# EAGLE design SchemaRobotV1.0 (EAGLE 8.7.0)
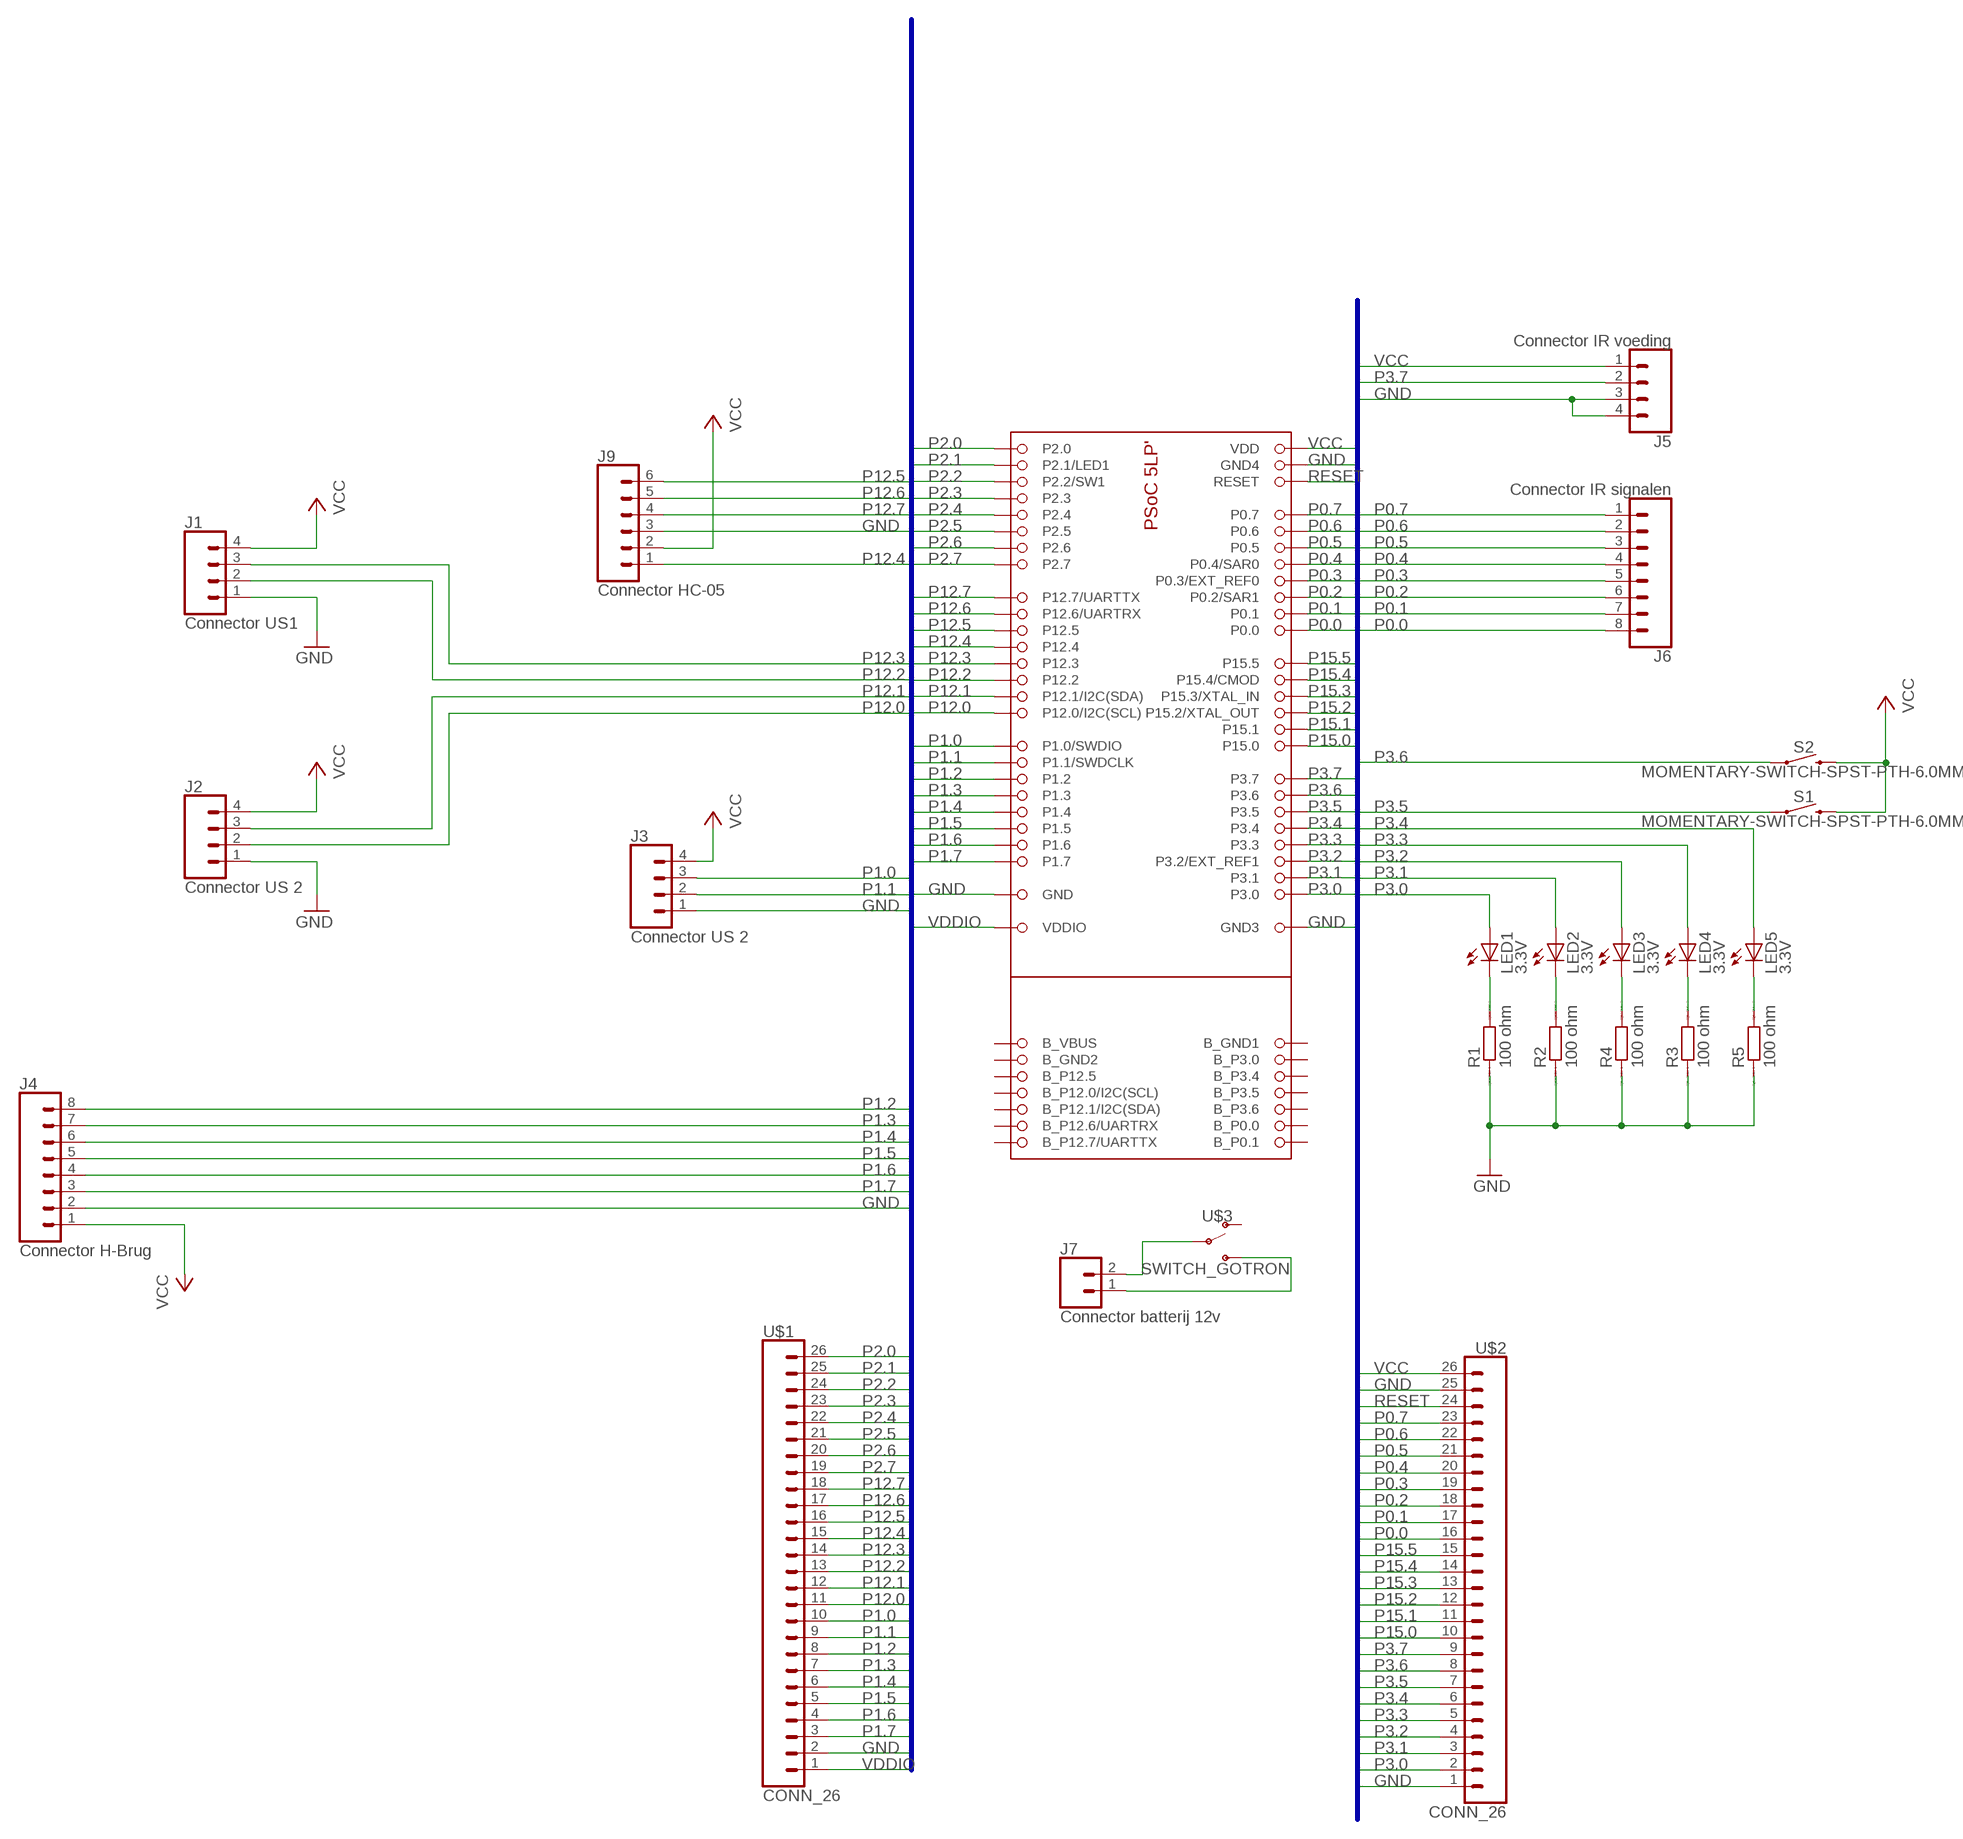
[diagram p0: schematic, sheet 1]

## Parts
DEVICE1  CYPRESSFOOTPRINT_CYPRESS  [CYPRESSFOOTPRINT_CYPRESSFOOTPRINT]
J1  Connector US1  CONN_04SCREW  [SCREWTERMINAL-3.5MM-4]
J2  Connector US 2  CONN_04SCREW  [SCREWTERMINAL-3.5MM-4]
J3  Connector US 2  CONN_04SCREW  [SCREWTERMINAL-3.5MM-4]
J4  Connector H-Brug  CONN_083.5MM-8  [SCREWTERMINAL-3.5MM-8]
J5  Connector IR voeding  CONN_04SCREW  [SCREWTERMINAL-3.5MM-4]
J6  Connector IR signalen  CONN_083.5MM-8  [SCREWTERMINAL-3.5MM-8]
J7  Connector batterij 12v  CONN_023.5MM  [SCREWTERMINAL-3.5MM-2]
J9  Connector HC-05  CONN_06LOCK  [1X06_LOCK]
LED1  3.3V  LED5MM  [LED5MM]
LED2  3.3V  LED5MM  [LED5MM]
LED3  3.3V  LED5MM  [LED5MM]
LED4  3.3V  LED5MM  [LED5MM]
LED5  3.3V  LED5MM  [LED5MM]
R1  100 ohm  R0204/7  [0204/7]
R2  100 ohm  R0204/7  [0204/7]
R3  100 ohm  R0204/7  [0204/7]
R4  100 ohm  R0204/7  [0204/7]
R5  100 ohm  R0204/7  [0204/7]
S1  MOMENTARY-SWITCH-SPST-PTH-6.0MM  [TACTILE_SWITCH_PTH_6.0MM]
S2  MOMENTARY-SWITCH-SPST-PTH-6.0MM  [TACTILE_SWITCH_PTH_6.0MM]
U$1  CONN_26  [1X26]
U$2  CONN_26  [1X26]
U$3  SWITCH_GOTRON  [SWITCH_SPDT_PTH_11.6X5.60MM]

## Nets
GND [Ground]: DEVICE1.GND DEVICE1.GND3 DEVICE1.GND4 J1.1 J2.1 J3.1 J4.2 J5.3 J5.4 J9.3 R1.1 R2.1 R3.1 R4.1 R5.1 U$1.2 U$2.1 U$2.25
N$1: J7.2 U$3.2(P)
N$2: LED1.K(C) R1.2
N$3: LED2.K(C) R2.2
N$4: LED3.K(C) R4.2
N$5: LED4.K(C) R3.2
N$6: LED5.K(C) R5.2
N$7: J7.1 U$3.3(S)
P0.0: DEVICE1.P0.0 J6.8 U$2.16
P0.1: DEVICE1.P0.1 J6.7 U$2.17
P0.2: DEVICE1.P0.2/SAR1 J6.6 U$2.18
P0.3: DEVICE1.P0.3/EXT_REF0 J6.5 U$2.19
P0.4: DEVICE1.P0.4/SAR0 J6.4 U$2.20
P0.5: DEVICE1.P0.5 J6.3 U$2.21
P0.6: DEVICE1.P0.6 J6.2 U$2.22
P0.7: DEVICE1.P0.7 J6.1 U$2.23
P1.0: DEVICE1.P1.0/SWDIO J3.3 U$1.10
P1.1: DEVICE1.P1.1/SWDCLK J3.2 U$1.9
P1.2: DEVICE1.P1.2 J4.8 U$1.8
P1.3: DEVICE1.P1.3 J4.7 U$1.7
P1.4: DEVICE1.P1.4 J4.6 U$1.6
P1.5: DEVICE1.P1.5 J4.5 U$1.5
P1.6: DEVICE1.P1.6 J4.4 U$1.4
P1.7: DEVICE1.P1.7 J4.3 U$1.3
P2.0: DEVICE1.P2.0 U$1.26
P2.1: DEVICE1.P2.1/LED1 U$1.25
P2.2: DEVICE1.P2.2/SW1 U$1.24
P2.3: DEVICE1.P2.3 U$1.23
P2.4: DEVICE1.P2.4 U$1.22
P2.5: DEVICE1.P2.5 U$1.21
P2.6: DEVICE1.P2.6 U$1.20
P2.7: DEVICE1.P2.7 U$1.19
P3.0: DEVICE1.P3.0 LED1.A U$2.2
P3.1: DEVICE1.P3.1 LED2.A U$2.3
P3.2: DEVICE1.P3.2(P3.2/EXT_REF1) LED3.A U$2.4
P3.3: DEVICE1.P3.3 LED4.A U$2.5
P3.4: DEVICE1.P3.4 LED5.A U$2.6
P3.5: DEVICE1.P3.5 S1.1 U$2.7
P3.6: DEVICE1.P3.6 S2.1 U$2.8
P3.7: DEVICE1.P3.7 J5.2 U$2.9
P12.0: DEVICE1.P12.0/I2C(SCL) J2.2 U$1.11
P12.1: DEVICE1.P12.1/I2C(SDA) J2.3 U$1.12
P12.2: DEVICE1.P12.2 J1.2 U$1.13
P12.3: DEVICE1.P12.3 J1.3 U$1.14
P12.4: DEVICE1.P12.4 J9.1 U$1.15
P12.5: DEVICE1.P12.5 J9.6 U$1.16
P12.6: DEVICE1.P12.6/UARTRX J9.5 U$1.17
P12.7: DEVICE1.P12.7/UARTTX J9.4 U$1.18
P15.0: DEVICE1.P15.0 U$2.10
P15.1: DEVICE1.P15.1 U$2.11
P15.2: DEVICE1.P15.2/XTAL_OUT U$2.12
P15.3: DEVICE1.P15.3/XTAL_IN U$2.13
P15.4: DEVICE1.P15.4/CMOD U$2.14
P15.5: DEVICE1.P15.5 U$2.15
RESET: DEVICE1.RESET U$2.24
VCC: DEVICE1.VVD(VDD) J1.4 J2.4 J3.4 J4.1 J5.1 J9.2 S1.3 S2.3 U$2.26
VDDIO: DEVICE1.VDDIO U$1.1
Unconnected: DEVICE1.B_12.0/I2C(SCL)(B_P12.0/I2C(SCL)) DEVICE1.B_12.1/I2C(SDA)(B_P12.1/I2C(SDA)) DEVICE1.B_12.6/UARTRX(B_P12.6/UARTRX) DEVICE1.B_12.7/UARTTX(B_P12.7/UARTTX) DEVICE1.B_GND1 DEVICE1.B_GND2 DEVICE1.B_P0.0 DEVICE1.B_P0.1 DEVICE1.B_P3.0 DEVICE1.B_P3.4 DEVICE1.B_P3.5 DEVICE1.B_P3.6 DEVICE1.B_P12.5 DEVICE1.B_VBUS U$3.1(O)

## Buses
P2.0,P2.1,P2.2,P2.3,P2.4,P2.5,P2.6,P2.7,P12.7,P12.6,P12.5,P12.4,P12.3,P12.2,P12.1,P12.0,P1.0,P1.1,P1.2,P1.3,P1.4,P1.5,P1.6,P1.7,GND,VDDIO
VCC,GND,RESET,P0.7,P0.6,P0.5,P0.4,P0.3,P0.2,P0.1,P0.0,P15.5,P15.4,P15.3,P15.2,P15.1,P15.0,P3.7,P3.6,P3.5,P3.4,P3.3,P3.2,P3.1,P3.0

## Library data of the parts
DEVICE1 = Board_1_23:CYPRESSFOOTPRINT_CYPRESS
J1-J3 J5 = SparkFun-Connectors:CONN_04: Multi connection point. Often used as Generic Header-pin footprint for 0.1 inch spaced/style header connections On any of the 0.1 inch spaced packages, you can populate with these: Break Away Headers - Straight <https://www.sparkfun.com/products/116> (PRT-00116) Break Away Male Headers - Right Angle <https://www.sparkfun.com/products/553> (PRT-00553) Female Headers <https://www.sparkfun.com/products/115> (PRT-00115) Break Away Headers - Machine Pin <https://www.sparkfun.com/products/117> (PRT-00117) Break Away Female Headers - Swiss Machine Pin <https://www.sparkfun.com/products/743> (PRT-00743) For SCREWTERMINALS and SPRING TERMINALS visit here: Screw Terimnals on SparkFun.com <https://www.sparkfun.com/search/results?term=Screw+Terminals> (5mm/3.5mm/2.54mm spacing) This device is also useful as a general connection point to wire up your design to another part of your project. Our various solder wires solder well into these plated through hole pads. Hook-Up Wire - Assortment (Stranded, 22 AWG) <https://www.sparkfun.com/products/11375> (PRT-11375) Hook-Up Wire - Assortment (Solid Core, 22 AWG) <https://www.sparkfun.com/products/11367> (PRT-11367) View the entire wire category on our website here <https://www.sparkfun.com/categories/141> Special notes: Molex polarized connector foot print use with SKU : PRT-08231 with associated crimp pins and housings. 1MM SMD Version SKU: PRT-10208; PROD_ID: 2xCONN-08399; SF_ID: 2xPRT-08084
J4 J6 = SparkFun-Connectors:CONN_08: Multi connection point. Often used as Generic Header-pin footprint for 0.1 inch spaced/style header connections On any of the 0.1 inch spaced packages, you can populate with these: Break Away Headers - Straight <https://www.sparkfun.com/products/116> (PRT-00116) Break Away Male Headers - Right Angle <https://www.sparkfun.com/products/553> (PRT-00553) Female Headers <https://www.sparkfun.com/products/115> (PRT-00115) Break Away Headers - Machine Pin <https://www.sparkfun.com/products/117> (PRT-00117) Break Away Female Headers - Swiss Machine Pin <https://www.sparkfun.com/products/743> (PRT-00743) Arduino Stackable Header - 8 Pin <https://www.sparkfun.com/products/9279> (PRT-09279) For SCREWTERMINALS and SPRING TERMINALS visit here: Screw Terimnals on SparkFun.com <https://www.sparkfun.com/search/results?term=Screw+Terminals> (5mm/3.5mm/2.54mm spacing) This device is also useful as a general connection point to wire up your design to another part of your project. Our various solder wires solder well into these plated through hole pads. Hook-Up Wire - Assortment (Stranded, 22 AWG) <https://www.sparkfun.com/products/11375> (PRT-11375) Hook-Up Wire - Assortment (Solid Core, 22 AWG) <https://www.sparkfun.com/products/11367> (PRT-11367) View the entire wire category on our website here <https://www.sparkfun.com/categories/141> Special notes: Molex polarized connector foot print use with SKU : PRT-08231 with associated crimp pins and housings. 1MM SMD Version SKU: PRT-10208 NOTES ON THE VARIANTS LOCK and LOCK_LONGPADS... This footprint was designed to help hold the alignment of a through-hole component (i.e. 6-pin header) while soldering it into place. You may notice that each hole has been shifted either up or down by 0.005 of an inch from it's more standard position (which is a perfectly straight line). This slight alteration caused the pins (the squares in the middle) to touch the edges of the holes. Because they are alternating, it causes a "brace" to hold the component in place. 0.005 has proven to be the perfect amount of "off-center" position when using our standard breakaway headers. Although looks a little odd when you look at the bare footprint, once you have a header in there, the alteration is very hard to notice. Also,if you push a header all the way into place, it is covered up entirely on the bottom side.
J7 = SparkFun-Connectors:CONN_02: Multi connection point. Often used as Generic Header-pin footprint for 0.1 inch spaced/style header connections On any of the 0.1 inch spaced packages, you can populate with these: Break Away Headers - Straight <https://www.sparkfun.com/products/116> (PRT-00116) Break Away Male Headers - Right Angle <https://www.sparkfun.com/products/553> (PRT-00553) Female Headers <https://www.sparkfun.com/products/115> (PRT-00115) Break Away Headers - Machine Pin <https://www.sparkfun.com/products/117> (PRT-00117) Break Away Female Headers - Swiss Machine Pin <https://www.sparkfun.com/products/743> (PRT-00743) For SCREWTERMINALS and SPRING TERMINALS visit here: Screw Terimnals on SparkFun.com <https://www.sparkfun.com/search/results?term=Screw+Terminals> (5mm/3.5mm/2.54mm spacing) This device is also useful as a general connection point to wire up your design to another part of your project. Our various solder wires solder well into these plated through hole pads. Hook-Up Wire - Assortment (Stranded, 22 AWG) <https://www.sparkfun.com/products/11375> (PRT-11375) Hook-Up Wire - Assortment (Solid Core, 22 AWG) <https://www.sparkfun.com/products/11367> (PRT-11367) View the entire wire category on our website here <https://www.sparkfun.com/categories/141> Special notes: Molex polarized connector foot print use with: PRT-08233 with associated crimp pins and housings. 2.54_SCREWTERM for use with PRT-10571. 3.5mm Screw Terminal footprints for PRT-08084 5mm Screw Terminal footprints for use with PRT-08432; PROD_ID: CONN-08399
J9 = SparkFun-Connectors:CONN_06: Multi connection point. Often used as Generic Header-pin footprint for 0.1 inch spaced/style header connections On any of the 0.1 inch spaced packages, you can populate with these: Break Away Headers - Straight <https://www.sparkfun.com/products/116> (PRT-00116) Break Away Male Headers - Right Angle <https://www.sparkfun.com/products/553> (PRT-00553) Female Headers <https://www.sparkfun.com/products/115> (PRT-00115) Break Away Headers - Machine Pin <https://www.sparkfun.com/products/117> (PRT-00117) Break Away Female Headers - Swiss Machine Pin <https://www.sparkfun.com/products/743> (PRT-00743) Arduino Stackable Header - 6 Pin <https://www.sparkfun.com/products/9280> (PRT-09280) For SCREWTERMINALS and SPRING TERMINALS visit here: Screw Terimnals on SparkFun.com <https://www.sparkfun.com/search/results?term=Screw+Terminals> (5mm/3.5mm/2.54mm spacing) This device is also useful as a general connection point to wire up your design to another part of your project. Our various solder wires solder well into these plated through hole pads. Hook-Up Wire - Assortment (Stranded, 22 AWG) <https://www.sparkfun.com/products/11375> (PRT-11375) Hook-Up Wire - Assortment (Solid Core, 22 AWG) <https://www.sparkfun.com/products/11367> (PRT-11367) View the entire wire category on our website here <https://www.sparkfun.com/categories/141>
LED1-LED5 = led:LED: LED OSRAM: - CHIPLED LG R971, LG N971, LY N971, LG Q971, LY Q971, LO R971, LY R971 LH N974, LH R974 LS Q976, LO Q976, LY Q976 LO Q996 - Hyper CHIPLED LW Q18S LB Q993, LB Q99A, LB R99A - SideLED LS A670, LO A670, LY A670, LG A670, LP A670 LB A673, LV A673, LT A673, LW A673 LH A674 LY A675 LS A676, LA A676, LO A676, LY A676, LW A676 LS A679, LY A679, LG A679 - Hyper Micro SIDELED® LS Y876, LA Y876, LO Y876, LY Y876 LT Y87S - SmartLED LW L88C, LW L88S LB L89C, LB L89S, LG L890 LS L89K, LO L89K, LY L89K LS L896, LA L896, LO L896, LY L896 - TOPLED LS T670, LO T670, LY T670, LG T670, LP T670 LSG T670, LSP T670, LSY T670, LOP T670, LYG T670 LG T671, LOG T671, LSG T671 LB T673, LV T673, LT T673, LW T673 LH T674 LS T676, LA T676, LO T676, LY T676, LB T676, LH T676, LSB T676, LW T676 LB T67C, LV T67C, LT T67C, LS T67K, LO T67K, LY T67K, LW E67C LS E67B, LA E67B, LO E67B, LY E67B, LB E67C, LV E67C, LT E67C LW T67C LS T679, LY T679, LG T679 LS T770, LO T770, LY T770, LG T770, LP T770 LB T773, LV T773, LT T773, LW T773 LH T774 LS E675, LA E675, LY E675, LS T675 LS T776, LA T776, LO T776, LY T776, LB T776 LHGB T686 LT T68C, LB T68C - Hyper Mini TOPLED® LB M676 - Mini TOPLED Santana® LG M470 LS M47K, LO M47K, LY M47K Source: http://www.osram.convergy.de LUXEON: - LUMILED® LXK2-PW12-R00, LXK2-PW12-S00, LXK2-PW14-U00, LXK2-PW14-V00 LXK2-PM12-R00, LXK2-PM12-S00, LXK2-PM14-U00 LXK2-PE12-Q00, LXK2-PE12-R00, LXK2-PE12-S00, LXK2-PE14-T00, LXK2-PE14-U00 LXK2-PB12-K00, LXK2-PB12-L00, LXK2-PB12-M00, LXK2-PB14-N00, LXK2-PB14-P00, LXK2-PB14-Q00 LXK2-PR12-L00, LXK2-PR12-M00, LXK2-PR14-Q00, LXK2-PR14-R00 LXK2-PD12-Q00, LXK2-PD12-R00, LXK2-PD12-S00 LXK2-PH12-R00, LXK2-PH12-S00 LXK2-PL12-P00, LXK2-PL12-Q00, LXK2-PL12-R00 Source: www.luxeon.com KINGBRIGHT: KA-3528ASYC Source: www.kingbright.com
R1-R5 = eagle-ltspice:R: RESISTOR, European symbol; SPICEMODEL: NONE; SPICEPREFIX: R
S1 S2 = SparkFun-Switches:MOMENTARY-SWITCH-SPST: Momentary Switch (Pushbutton) - SPST Normally-open (NO) SPST momentary switches (buttons, pushbuttons). Variants PTH-12MM - 12mm square, through-hole Momentary Pushbutton Switch - 12mm Square <https://www.sparkfun.com/products/9190> (COM-09190) PTH-6.0MM, PTH-6.0MM-KIT - 6.0mm square, through-hole Mini Pushbutton Switch <https://www.sparkfun.com/products/97> (COM-00097) KIT package intended for soldering kit's - only one side of pads' copper is exposed. PTH-RIGHT-ANGLE-KIT - Right-angle, through-hole Right Angle Tactile Button <https://www.sparkfun.com/products/10791> - Used on SparkFun BigTime Watch Kit <https://www.sparkfun.com/products/11734> SMD-12MM - 12mm square, surface-mount Tactile Button - SMD (12mm) <https://www.sparkfun.com/products/12993> (COM-12993) Used on SparkFun PicoBoard <https://www.sparkfun.com/products/11888> SMD-4.5MM - 4.5mm Square Trackball Switch Used on SparkFun Blackberry Trackballer Breakout <https://www.sparkfun.com/products/13169> SMD-4.6MMX2.8MM - 4.60mm x 2.80mm, surface mount Used on SparkFun SAMD21 Mini Breakout <https://www.sparkfun.com/products/13664> SMD-5.2MM, SMD-5.2-REDUNDANT - 5.2mm square, surface-mount Mini Pushbutton Switch - SMD <https://www.sparkfun.com/products/8720> (COM-08720) Used on Arduino Pro Mini <https://www.sparkfun.com/products/11114> REDUNDANT package connects both switch circuits together SMD-6.0X3.5MM - 6.0 x 3.5mm, surface mount Momentary Reset Switch SMD <https://www.sparkfun.com/products/8229> (COM-08229) SMD-6.2MM-TALL - 6.2mm square, surface mount Tactile Button - SMD (6mm) <https://www.sparkfun.com/products/12992> Used on SparkFun Digital Sandbox <https://www.sparkfun.com/products/12651> SMD-RIGHT-ANGLE - Right-angle, surface mount Used on SparkFun Block for Intel® Edison - Arduino <https://www.sparkfun.com/products/13036>; PROD_ID: SWCH-08441; SF_SKU: COM-00097
U$1 U$2 = SparkFun-Connectors:CONN_26
U$3 = SparkFun-Switches:SWITCH_GOTRON

## Net classes
0 default: width 0.406 mm
1 Ground: width 0.61 mm
2 fromBat: width 0.61 mm
3 toBat: width 0.61 mm

## Board
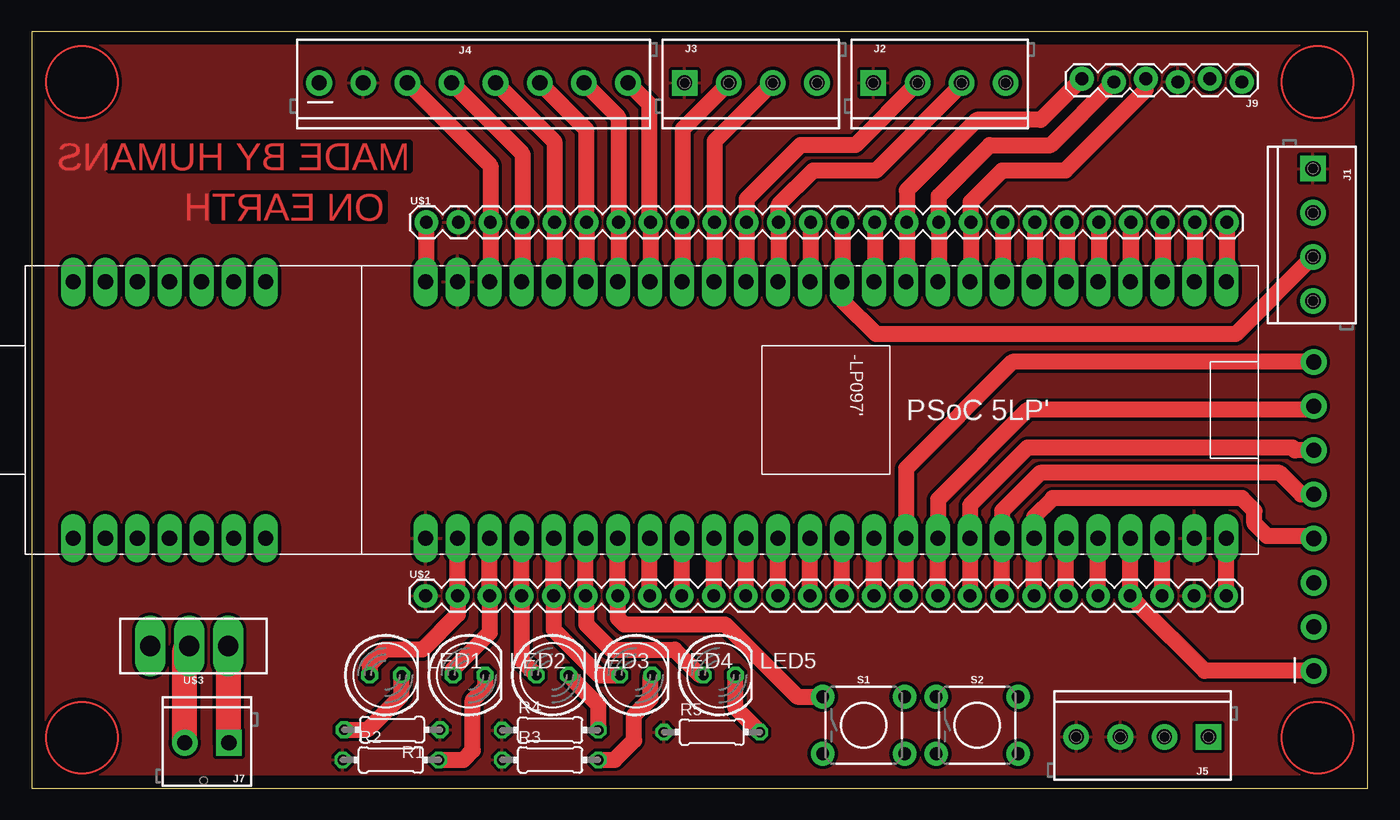
[diagram p1: board, top side]
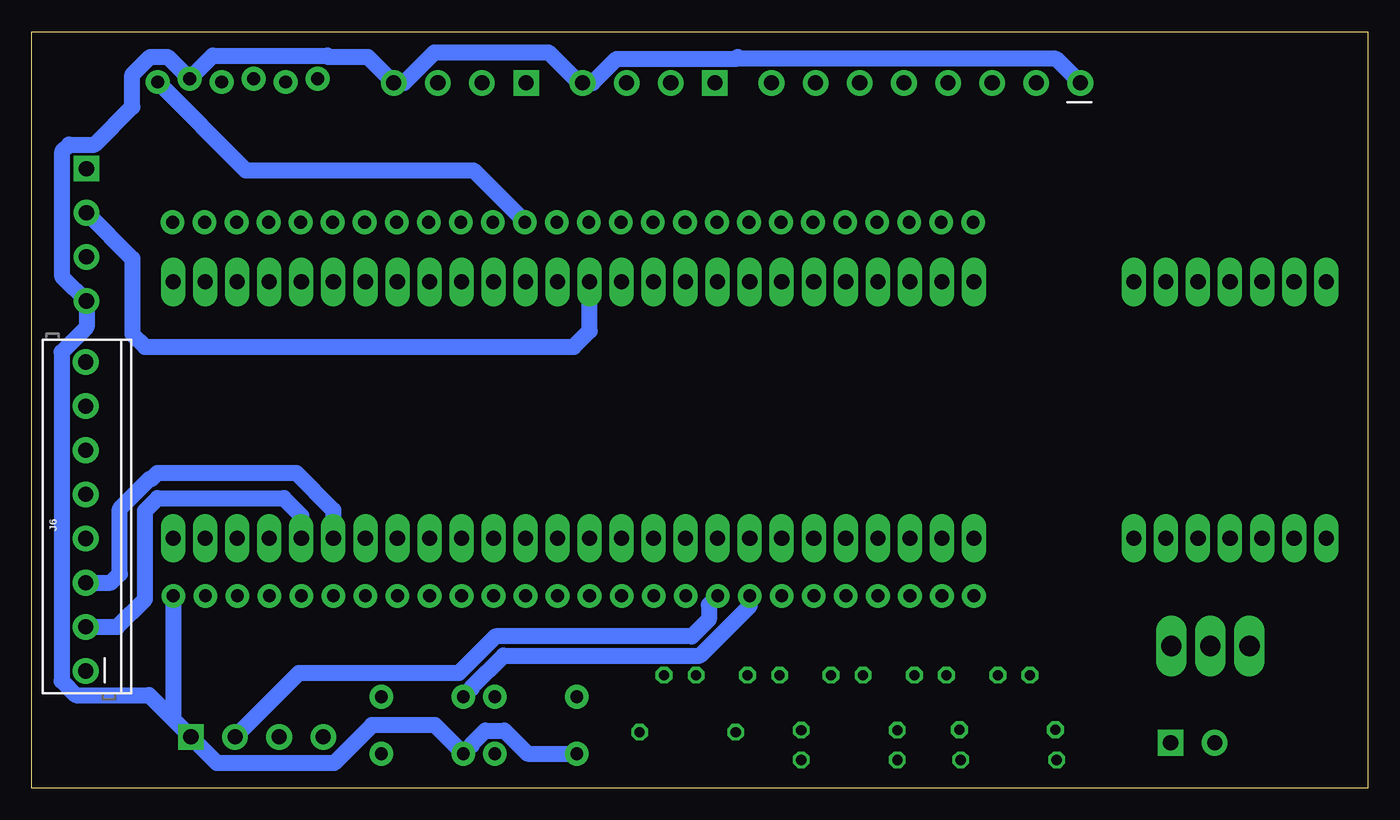
[diagram p2: board, bottom side, seen from below]

Size 106 x 60 mm. Coordinates in mm from the lower left corner, seen from the top.
Outline: 0,0 106,0 106,60 0,60 0,0
Copper layers (1*16): Top 0.035mm / dielectric 1.5mm / Bottom 0.035mm
Design rules "default *": minimum track width 6mil, minimum drill 0.35mm, track to track 10mil, track to pad 10mil, pad to pad 10mil, via to via 10mil, smd to smd 6mil, copper to edge 40mil, drill to drill 6mil, minimum pad ring 10mil, minimum via ring 8mil, stop-mask expansion 4mil, vias tented up to drill 0mil, thermal gap 10mil

### Footprints (pad centres in the part's own frame; a part is rotated, then mirrored left to right if it is on the bottom)
CYPRESSFOOTPRINT_CYPRESSFOOTPRINT = drill 1.2 pad 1.93 long: B_12.0/I2C(SCL) -36.83,10.16; B_12.1/I2C(SDA) -39.37,10.16; B_12.6/UARTRX -41.91,10.16; B_12.7/UARTTX -44.45,10.16; B_GND1 -29.21,-10.16; B_GND2 -31.75,10.16; B_P0.0 -41.91,-10.16; B_P0.1 -44.45,-10.16; B_P3.0 -31.75,-10.16; B_P3.4 -34.29,-10.16; B_P3.5 -36.83,-10.16; B_P3.6 -39.37,-10.16; B_P12.5 -34.29,10.16; B_VBUS -29.21,10.16; GND -13.97,10.16; GND3 -16.51,-10.16; GND4 44.45,-10.16; P0.0 21.59,-10.16; P0.1 24.13,-10.16; P0.2/SAR1 26.67,-10.16; P0.3/EXT_REF0 29.21,-10.16; P0.4/SAR0 31.75,-10.16; P0.5 34.29,-10.16; P0.6 36.83,-10.16; P0.7 39.37,-10.16; P1.0/SWDIO 6.35,10.16; P1.1/SWDCLK 3.81,10.16; P1.2 1.27,10.16; P1.3 -1.27,10.16; P1.4 -3.81,10.16; P1.5 -6.35,10.16; P1.6 -8.89,10.16; P1.7 -11.43,10.16; P2.0 46.99,10.16; P2.1/LED1 44.45,10.16; P2.2/SW1 41.91,10.16; P2.3 39.37,10.16; P2.4 36.83,10.16; P2.5 34.29,10.16; P2.6 31.75,10.16; P2.7 29.21,10.16; P3.0 -13.97,-10.16; P3.1 -11.43,-10.16; P3.2 -8.89,-10.16; P3.3 -6.35,-10.16; P3.4 -3.81,-10.16; P3.5 -1.27,-10.16; P3.6 1.27,-10.16; P3.7 3.81,-10.16; P12.0/I2C(SCL) 8.89,10.16; P12.1/I2C(SDA) 11.43,10.16; P12.2 13.97,10.16; P12.3 16.51,10.16; P12.4 19.05,10.16; P12.5 21.59,10.16; P12.6/UARTRX 24.13,10.16; P12.7/UARTTX 26.67,10.16; P15.0 6.35,-10.16; P15.1 8.89,-10.16; P15.2/XTAL_OUT 11.43,-10.16; P15.3/XTAL_IN 13.97,-10.16; P15.4/CMOD 16.51,-10.16; P15.5 19.05,-10.16; RESET 41.91,-10.16; VDDIO -16.51,10.16; VVD 46.99,-10.16
SCREWTERMINAL-3.5MM-4 = drill 1.2 pad 2.032 square: 1 0,0 | drill 1.2 pad 2.032: 2 3.5,0; 3 7,0; 4 10.5,0
SCREWTERMINAL-3.5MM-8 = drill 1.2 pad 2.032: 1 0,0; 2 3.5,0; 3 7,0; 4 10.5,0; 5 14,0; 6 17.5,0; 7 21,0; 8 24.5,0
SCREWTERMINAL-3.5MM-2 = drill 1.2 pad 2.032 square: 1 0,0 | drill 1.2 pad 2.032: 2 3.5,0
1X06_LOCK = drill 1.016 pad 1.88: 1 0,0; 2 2.54,-0.254; 3 5.08,0; 4 7.62,-0.254; 5 10.16,0; 6 12.7,-0.254
LED5MM = drill 0.813 octagon: A -1.27,0; K 1.27,0
0204/7 = drill 0.813 octagon: 1 -3.81,0; 2 3.81,0
TACTILE_SWITCH_PTH_6.0MM = drill 1.016 pad 1.88: 1 -3.251,2.261; 2 3.251,2.261; 3 -3.251,-2.261; 4 3.251,-2.261
1X26 = drill 1.016 pad 1.88: 1 0,0; 2 2.54,0; 3 5.08,0; 4 7.62,0; 5 10.16,0; 6 12.7,0; 7 15.24,0; 8 17.78,0; 9 20.32,0; 10 22.86,0; 11 25.4,0; 12 27.94,0; 13 30.48,0; 14 33.02,0; 15 35.56,0; 16 38.1,0; 17 40.64,0; 18 43.18,0; 19 45.72,0; 20 48.26,0; 21 50.8,0; 22 53.34,0; 23 55.88,0; 24 58.42,0; 25 60.96,0; 26 63.5,0
SWITCH_SPDT_PTH_11.6X5.60MM = drill 1.6 pad 1.88 long: 1 2.286,-2.4; 2 2.286,-5.5; 3 2.286,-8.6

### Placement (x,y rotation side)
DEVICE1  47.77,29.99 0 top
J1  101.64,49.13 270 top
J2  66.77,55.93 0 top
J3  51.8,55.93 0 top
J4  22.81,55.93 0 top
J5  93.36,4.08 180 top
J6  101.7,9.3 90 bottom
J7  15.66,3.61 180 top
J9  96,56 180 top
LED1  28.08,8.97 0 top
LED2  34.7,8.97 0 top
LED3  41.32,8.97 0 top
LED4  47.94,8.97 0 top
LED5  54.56,8.97 0 top
R1  28.6,4.64 180 top
R2  28.5,2.25 0 top
R3  41.14,2.25 0 top
R4  41.14,4.61 0 top
R5  53.96,4.45 0 top
S1  66,5 0 top
S2  75,5 0 top
U$1  31.32,44.87 0 top
U$2  31.25,15.25 0 top
U$3  7,9 90 top

### Tracks (layer width: path | path; a pad name or v marks a point on that pad's centre or on a via)
GND
  pour Top: 0,60 106,60 106,0 0,0
N$1
  Top 2: J7.2 12.16,10.95 U$3.2
N$2
  Top 1.27: R1.2 26.64,4.64 29.35,7.35 LED1.K
N$3
  Top 1.27: R2.2 34.25,2.25 35,3 35,7 36,8 36,8.94 LED2.K
N$4
  Top 1.27: LED3.K 44.95,6.61 R4.2
N$5
  Top 1.27: R3.2 46.25,2.25 47.8,3.8 47.8,5.8 49.1,7.1 49.1,8.86 LED4.K
N$6
  Top 1.27: R5.2 55.83,6.39 LED5.K
N$7
  Top 2: U$3.3 15.6,3.67 J7.1
P0.0
  Top 1.27: U$2.16 DEVICE1.P0.0 | DEVICE1.P0.0 | J6.8 77.8,33.8 69.35,25.35 DEVICE1.P0.0
P0.1
  Top 1.27: U$2.17 DEVICE1.P0.1 | DEVICE1.P0.1 | J6.7 101.4,30 79,30 71.89,22.89 DEVICE1.P0.1
P0.2
  Top 1.27: U$2.18 DEVICE1.P0.2/SAR1 74.44,22.44 79,27 100,27 100.2,26.8 J6.6
P0.3
  Top 1.27: U$2.19 DEVICE1.P0.3/EXT_REF0 | DEVICE1.P0.3/EXT_REF0 | DEVICE1.P0.3/EXT_REF0 76.97,20.97 76.97,21.97 80,25 99,25 100.7,23.3 J6.5
P0.4
  Top 1.27: U$2.20 DEVICE1.P0.4/SAR0 | DEVICE1.P0.4/SAR0 | DEVICE1.P0.4/SAR0 79.51,21.51 81,23 96,23 97,22 97,21 98,20 101.5,20 J6.4
P0.5
  Top 1.27: U$2.21 DEVICE1.P0.5
  Bottom 1.27: J6.3 99.7,16.3 99,17 99,22.16 96.63,24.52 96.48,24.52 96,25 85,25 82.06,22.06 DEVICE1.P0.5
P0.6
  Top 1.27: U$2.22 DEVICE1.P0.6
  Bottom 1.27: J6.2 99.2,12.8 97,15 97,22 96,23 86,23 84.6,21.6 DEVICE1.P0.6
P0.7
  Top 1.27: DEVICE1.P0.7 U$2.23 87.84,14.54 87.84,14.5 93.04,9.3 J6.1
P1.0
  Top 1.27: DEVICE1.P1.0/SWDIO 54.17,40.2 U$1.10 54.17,51.3 J3.3
P1.1
  Top 1.27: DEVICE1.P1.1/SWDCLK 51.63,40.2 U$1.9 51.63,52.27 J3.2
P1.2
  Top 1.27: DEVICE1.P1.2 49.09,40.2 U$1.8 49,44.97 49,54.24 J4.8
P1.3
  Top 1.27: DEVICE1.P1.3 46.55,40.2 U$1.7 46.55,53.19 J4.7
P1.4
  Top 1.27: DEVICE1.P1.4 44.02,40.2 U$1.6 44,44.89 44,52.24 J4.6
P1.5
  Top 1.27: DEVICE1.P1.5 41.48,40.2 U$1.5 41.48,51.27 J4.5
P1.6
  Top 1.27: DEVICE1.P1.6 38.94,40.2 U$1.4 38.94,50.3 J4.4
P1.7
  Top 1.27: DEVICE1.P1.7 36.4,40.2 U$1.3 36.4,49.34 J4.3
P2.0
  Top 1.27: U$1.26 94.81,40.2 DEVICE1.P2.0
P2.1
  Top 1.27: U$1.25 92.28,40.2 DEVICE1.P2.1/LED1
P2.2
  Top 1.27: U$1.24 89.73,40.2 DEVICE1.P2.2/SW1
P2.3
  Top 1.27: 87,40 87.19,40.2 U$1.23 87.19,40.2 DEVICE1.P2.3
P2.4
  Top 1.27: U$1.22 84.66,40.2 DEVICE1.P2.4
P2.5
  Top 1.27: U$1.21 82.11,40.2 DEVICE1.P2.5
P2.6
  Top 1.27: U$1.20 79.58,40.2 DEVICE1.P2.6
P2.7
  Top 1.27: U$1.19 77.03,40.2 DEVICE1.P2.7
P3.0
  Top 1.27: DEVICE1.P3.0 U$2.2 33.79,13.79 31,11 28,11 26.81,9.81 LED1.A
P3.1
  Top 1.27: DEVICE1.P3.1 U$2.3 36.33,12.33 33.43,9.43 LED2.A
P3.2
  Top 1.27: DEVICE1.P3.2 U$2.4 38.87,10.15 LED3.A
P3.3
  Top 1.27: DEVICE1.P3.3 U$2.5 41.41,12.59 45.03,8.97 LED4.A
P3.4
  Top 1.27: DEVICE1.P3.4 U$2.6 44,15.21 44,13 46,11 51,11 53.03,8.97 LED5.A
P3.5
  Top 1.27: DEVICE1.P3.5 U$2.7 46.49,13.51 47,13 55,13 60.74,7.26 S1.1
P3.6
  Top 1.27: U$2.8 DEVICE1.P3.6
  Bottom 1.27: S2.1 71.08,7.93 71.08,8.02 68.58,10.52 53,10.52 49.03,14.48 U$2.8
P3.7
  Top 1.27: U$2.9 DEVICE1.P3.7
  Bottom 1.27: U$2.9 52.28,14.54 52.28,13.39 53.63,12.04 69.21,12.04 72.13,9.13 84.81,9.13 J5.2
P12.0
  Top 1.27: DEVICE1.P12.0/I2C(SCL) 56.72,40.2 U$1.11 56.72,46.72 61,51 65.34,51 J2.2
P12.1
  Top 1.27: DEVICE1.P12.1/I2C(SDA) 59.26,40.2 U$1.12 59.26,46.26 62,49 67,49 73.77,55.77 J2.3
P12.2
  Top 1.27: U$1.13 61.8,40.2 DEVICE1.P12.2
  Bottom 1.27: J1.2 98,41.99 98,36 97,35 63,35 61.74,36.26 DEVICE1.P12.2
P12.3
  Top 1.27: U$1.14 64.33,40.2 | 64.33,40.2 DEVICE1.P12.3 | J1.3 95.51,36 67,36 64.33,38.66 64.33,40.2
P12.4
  Top 1.27: U$1.15 66.88,40.2 DEVICE1.P12.4
  Bottom 1.27: J9.1 89,49 70.96,49 66.88,44.92 U$1.15
P12.5
  Top 1.27: DEVICE1.P12.5 69.42,40.2 U$1.16 69.42,47.41 75,53 80.05,53 J9.6
P12.6
  Top 1.27: DEVICE1.P12.6/UARTRX 71.95,40.2 U$1.17 71.95,46.95 76,51 80.84,51 J9.5
P12.7
  Top 1.27: DEVICE1.P12.7/UARTTX 74.5,40.2 U$1.18 74.5,46.49 77,49 82,49 88.38,55.38 J9.4
P15.0
  Top 1.27: U$2.10 DEVICE1.P15.0
P15.1
  Top 1.27: U$2.11 DEVICE1.P15.1
P15.2
  Top 1.27: U$2.12 DEVICE1.P15.2/XTAL_OUT
P15.3
  Top 1.27: U$2.13 DEVICE1.P15.3/XTAL_IN
P15.4
  Top 1.27: U$2.14 DEVICE1.P15.4/CMOD
P15.5
  Top 1.27: U$2.15 DEVICE1.P15.5
RESET
  Top 1.27: U$2.24 DEVICE1.RESET
VCC
  Top 1.27: U$2.26 DEVICE1.VVD
  Bottom 1.27: U$2.26 94.75,5.47 J5.1 | J5.1 91.28,2 82,2 79,5 74.01,5 S2.3 71.08,3.41 71.08,3.5 70.01,4.57 68.49,4.57 66.67,2.74 S1.3 | 50.16,57.84 50,58 | 50.16,57.84 59.59,57.84 61.49,55.93 J3.4 62.58,55.93 65,58.35 74.05,58.35 76.46,55.93 J2.4 79.34,58 82.46,58 82.54,58.08 91.63,58.08 J9.2 95.21,58 96.59,58 98,56.59 98,54.03 101,51.03 103.02,51.03 103.55,50.51 103.55,40.53 J1.4 101.64,36.55 103.61,34.59 103.61,8.51 102.49,7.39 96.67,7.39 J5.1 | J4.1 24.71,57.84 50.16,57.84
VDDIO
  Top 1.27: U$1.1 31.32,40.2 DEVICE1.VDDIO
(copper drawn outside any net)
  shapes: Top circle x4

### Text on the board
Top: MADE BY HUMANS | ON EARTH